# Altium schematic sheet 11_CHANGE_LOG.SchDoc
size A2; ApprovedBy: DNP; CheckedBy: DNP; Author: DNP; CompanyName: Google LLC; DrawnBy: DNP; Engineer: Bangfei/Michael/Leo; Organization: Google LLC; Address1: 1600 Amphitheatre Parkway; Address2: Mountain View, CA 94043; Address3: DNP; Address4: DNP; DocumentNumber: DNP; Revision: PVT; SheetNumber: 11; SheetTotal: 11; VersionControl_RevNumber: DNP; IsUserConfigurable: DNP; Time: DNP; ImagePath: DNP; Rule: DNP; ProjectName: Enterprise; Application_BuildNumber: DNP
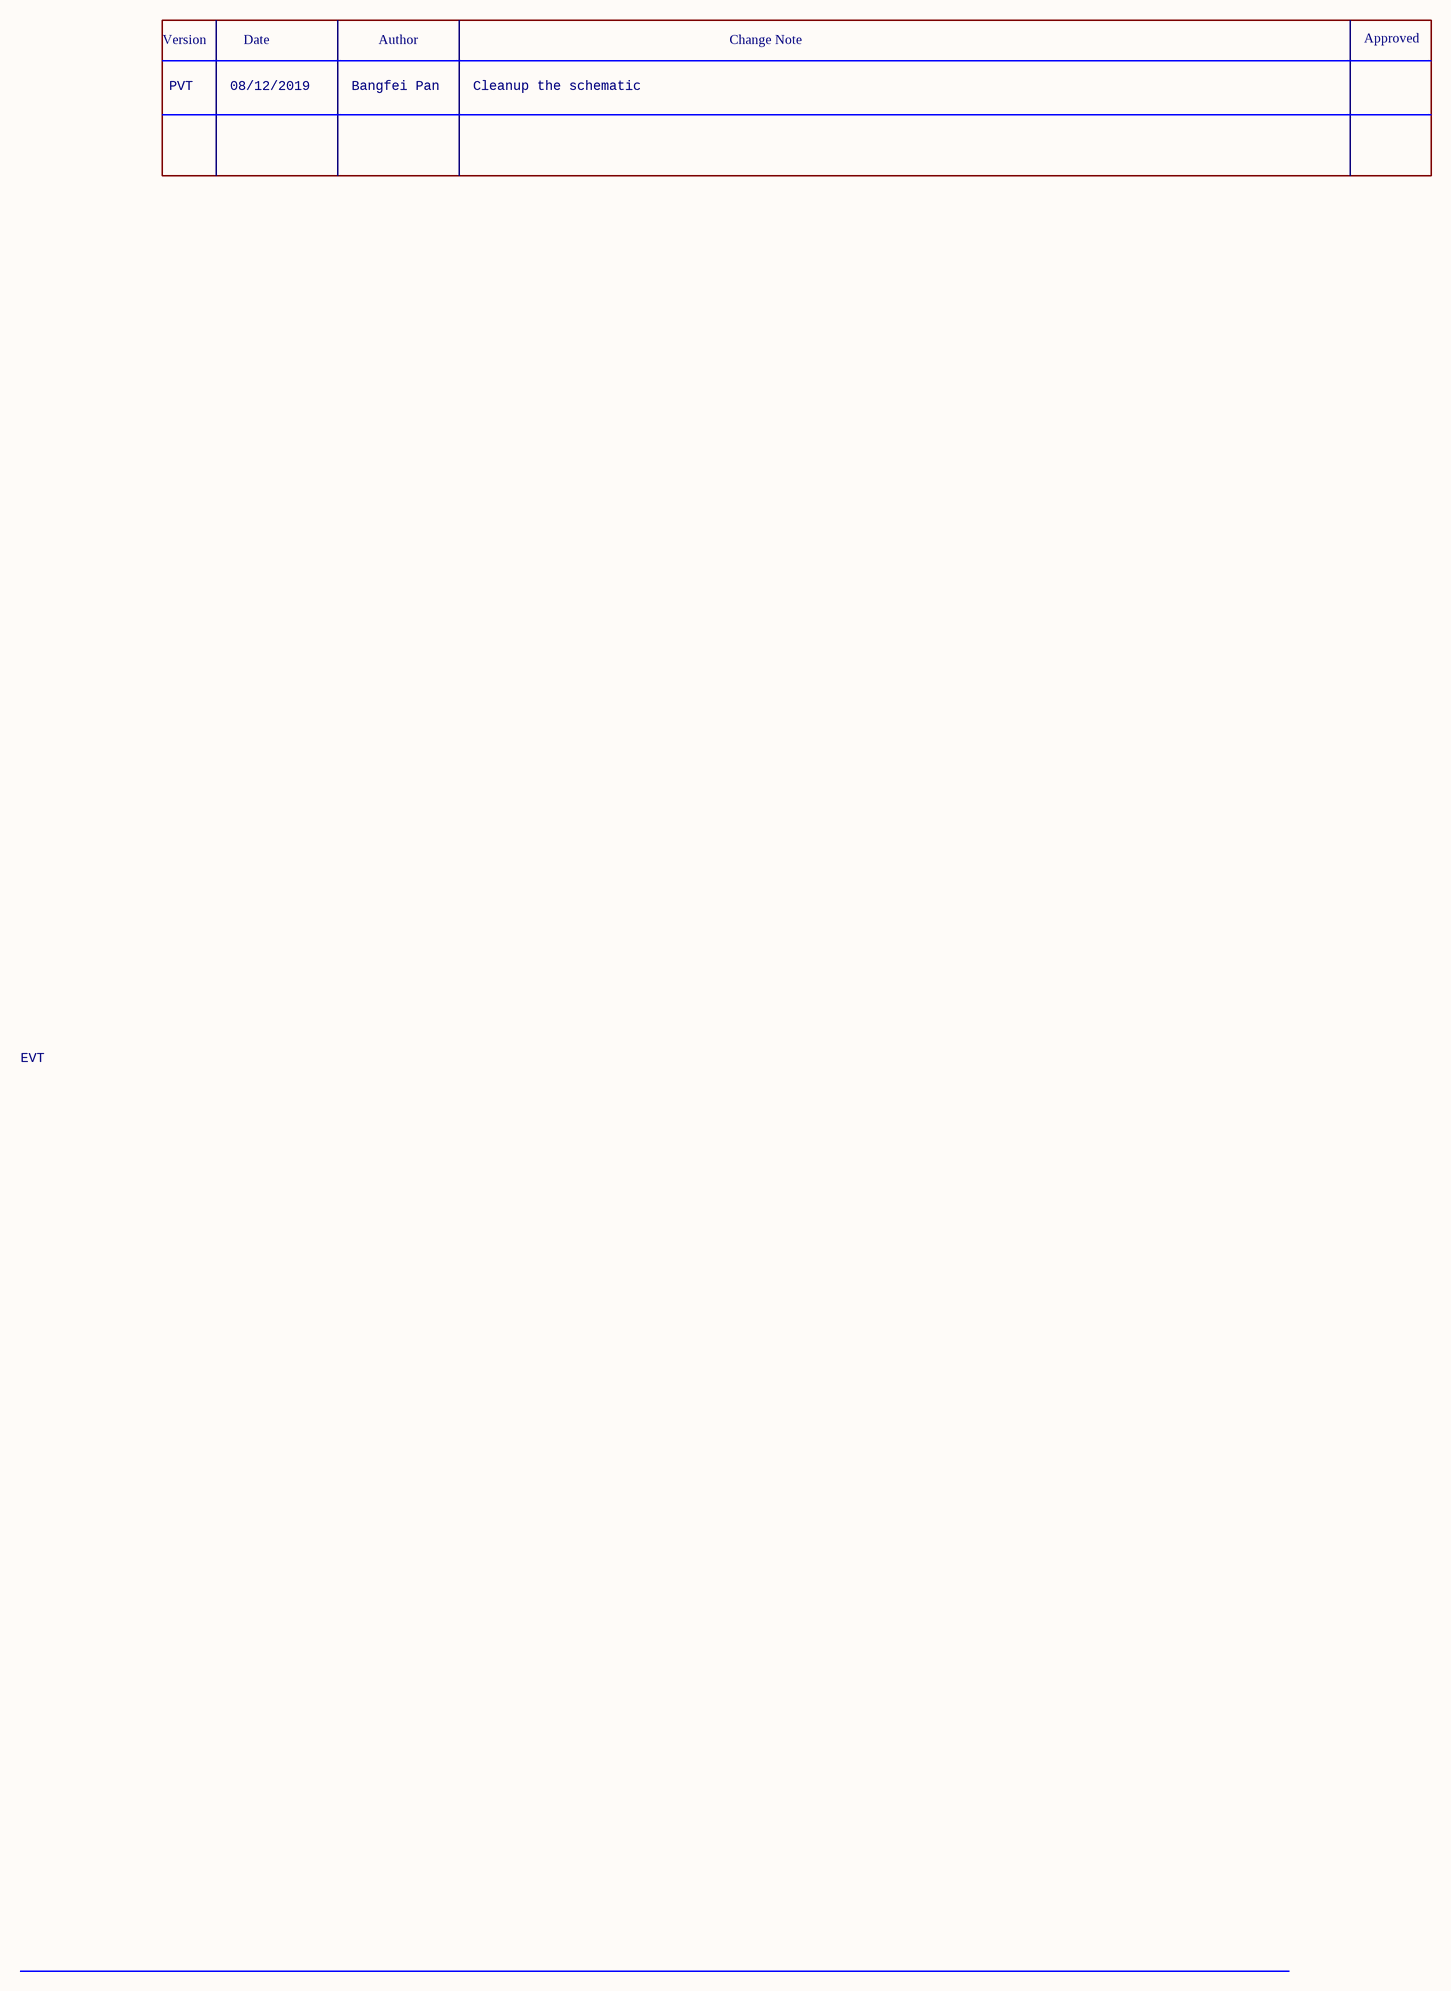
[diagram p0: 11_CHANGE_LOG.SchDoc]

## Notes on the sheet
- Version
- Date
- Author
- Change Note
- Approved
- PVT
- 08/12/2019
- Bangfei Pan
- Cleanup the schematic
- EVT
- Project:
- Engineer:
- Date:
- File:
- Revision:
- Sheet
- of